# Altium project PCB_Uno trung tam nha kinh.PrjPcb
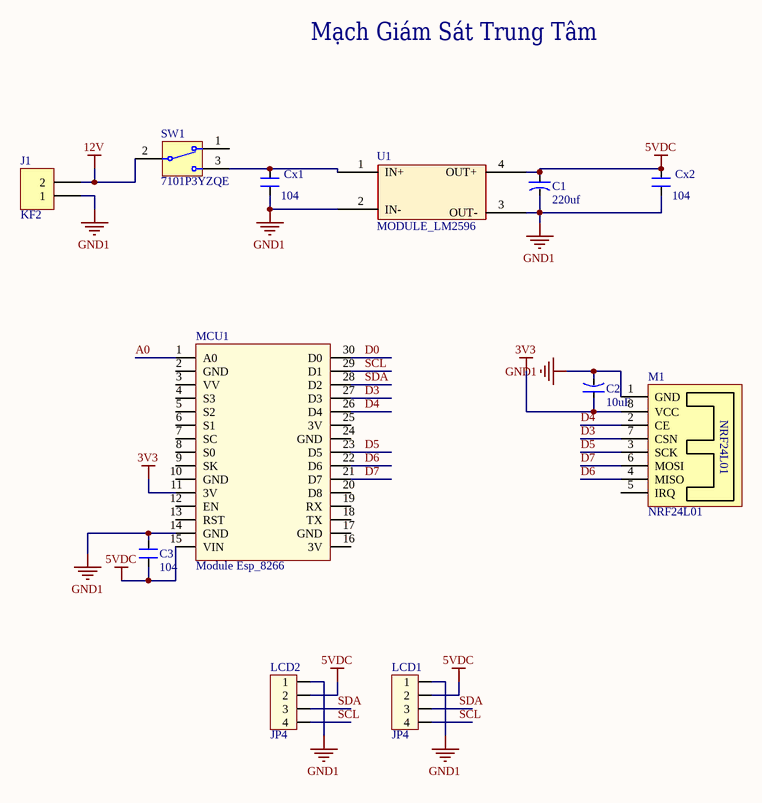
[diagram p0: Uno trung tam nha kinh.SchDoc]
1 sheet, 12 parts. Net scope: global (net labels, ports and power ports of the same name join across sheets).
Board file: Uno trung tam nha kinh.PcbDoc

## Sheet Uno trung tam nha kinh.SchDoc
size A2; SheetNumber: 1; SheetTotal: 1

### Parts
C1  220uf  [CA-ALU-10R]
C2  10uF  [CA-ALU-6.3R]
C3  104  [CN2-T]
Cx1  104  [CN2-T]
Cx2  104  [CN2-T]
J1  KF2  [KF2-5.08]
LCD1  JP4  [CON4]
LCD2  JP4  [CON4]
M1  NRF24L01  [NRF24L01]
MCU1  Module Esp_8266  [Esp8266_NodeMCU_CP2102]
SW1  7101P3YZQE  [SW_TOGGLE_7101P3YZQE]
U1  MODULE_LM2596  [MODULE_LM2596]

### Nets
3V3: C2.1 M1.8(VCC) MCU1.11(3V)
5VDC: C1.1 C3.1 Cx2.2 LCD1.2 LCD2.2 MCU1.15(VIN) U1.4(OUT+)
12V: J1.2 SW1.2(COM)
GND1: C1.2 C2.2 C3.2 Cx1.1 Cx2.1 J1.1 LCD1.1 LCD2.1 M1.1(GND) MCU1.14(GND) U1.2(IN-) U1.3(OUT-)
A0: MCU1.1(A0)
D0: MCU1.30(D0)
D3: M1.7(CSN) MCU1.27(D3)
D4: M1.2(CE) MCU1.26(D4)
D5: M1.3(SCK) MCU1.23(D5)
D6: M1.4(MISO) MCU1.22(D6)
D7: M1.6(MOSI) MCU1.21(D7)
SCL: LCD1.4 LCD2.4 MCU1.29(D1)
SDA: LCD1.3 LCD2.3 MCU1.28(D2)
NetCx1_2: Cx1.2 SW1.3(NO) U1.1(IN+)

Not connected (* = marked no-connect by the designer): M1 5(IRQ); MCU1 2(GND) 3(VV) 4(S3) 5(S2) 6(S1) 7(SC) 8(S0) 9(SK) 10(GND) 12(EN) 13(RST) 16(3V) 17(GND) 18(TX) 19(RX) 20(D8) 24(GND) 25(3V); SW1 1(NC)

### Notes on the sheet
- Mạch Giám Sát Trung Tâm

### Library data of the parts
C1 C2 = CN-ALU-DIP: Capacitor (Semiconductor SIM Model); Value: 104; LatestRevisionDate: 17-Jul-2002; LatestRevisionNote: Re-released for DXP Platform.; PackageReference: C1206; Publisher: Altium Limited
C3 Cx1 Cx2 = CN: Value: 33pF
J1 = KF2: Manufacturer: Würth Elektronik eiSos GmbH; partNo: 691103110002; ComponentLink1 Description: Manufacturer; ComponentLink2 Description: Datasheet; NoPins: 2; Created Date: 29 October 2013; ComponentLink1URL: http://www.we-online.com; ComponentLink2URL: http://katalog.we-online.de/em/datasheet/6911031100xx.pdf; Created by: Karrer Zheng
LCD1 LCD2 = Con4: Connector 4; Value: Connector 4
SW1 = SW_TOGGLE_7101P3YZQE: SWITCH TOGGLE SPDT 5A 120V; Manufacturer: C&K; Switch Function: On-On; Current Rating: 5A (AC/DC); Voltage Rating - DC: 28V; Actuator Type: Flat Anti-Rotation; Actuator Length: 11.43mm; Illumination: Non-Illuminated; Actuator Material: Brass, Chrome Plated; Electrical Life: 100,000 Cycles; Supplier 1: Digi-Key; Manufacturer Part Number: 7101P3YZQE; RoHS: RoHS Compliant; Category: Switches; Stock 1: 933; Pricing 1: 1=6.11, 10=5.801, 25=5.648, 50=5.4954, 100=5.3428, 250=5.03744, 500=4.2742, 1000=4.04523 (USD); Packaging: Bulk; Part Status: Active; Circuit: SPDT; Voltage Rating - AC: 120V; Illumination Type, Color: -; Illumination Voltage (Nominal): -; Mounting Type: Panel Mount; Termination Style: Solder Lug; Panel Cutout Dimensions: Circular - 6.35mm Dia; Bushing Thread: 1/4-40; Ingress Protection: -; Features: Epoxy Sealed Terminals; Operating Temperature: -30°C ~ 85°C; ComponentLink1URL: http://www.ckswitches.com/media/1394/7000toggle.pdf; ComponentLink1Description: http://www.ckswitches.com/media/1394/7000toggle.pdf; Supplier Part Number 1: CKN1019-ND